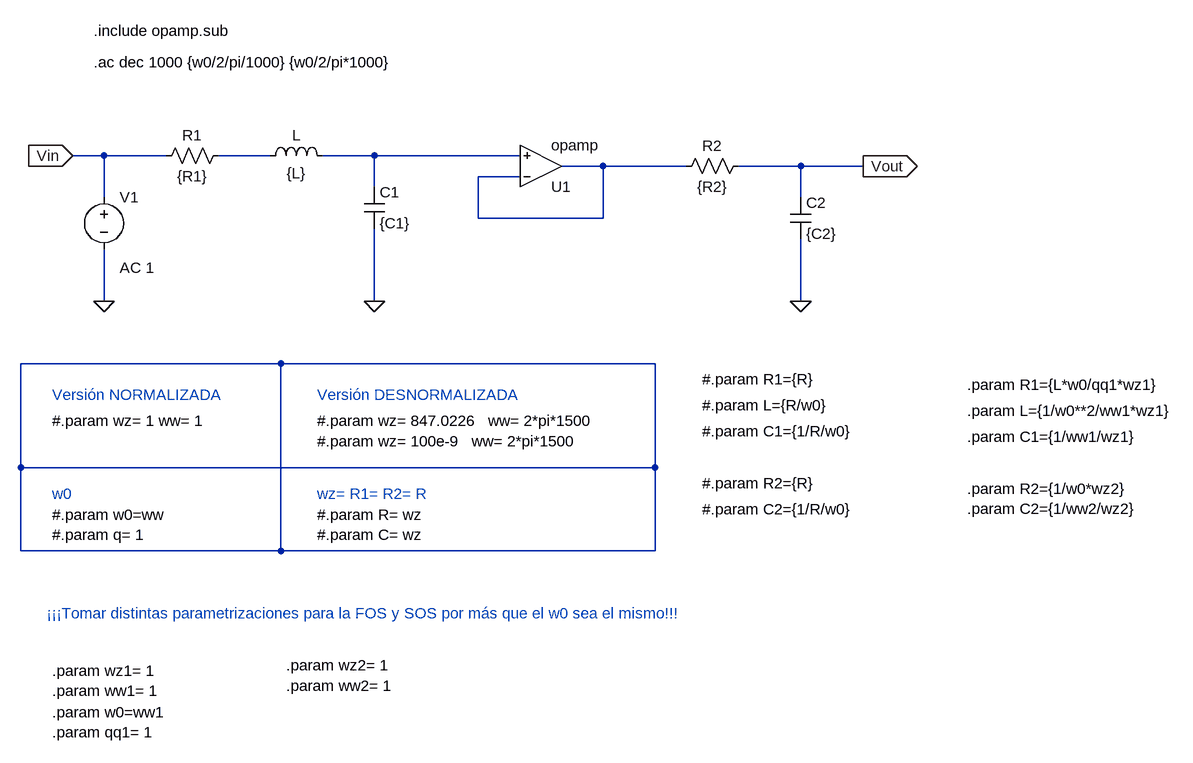
[diagram p0: schematic TS3_LTSpice.asc]
TS3_LTSpice.asc, the LTspice schematic file:
Version 4
SHEET 1 1836 888
WIRE -400 -208 -448 -208
WIRE -304 -208 -400 -208
WIRE -144 -208 -224 -208
WIRE 16 -208 -64 -208
WIRE 240 -208 16 -208
WIRE 368 -192 304 -192
WIRE 496 -192 368 -192
WIRE 672 -192 576 -192
WIRE 768 -192 672 -192
WIRE 240 -176 176 -176
WIRE 16 -160 16 -208
WIRE -400 -144 -400 -208
WIRE 672 -144 672 -192
WIRE 176 -112 176 -176
WIRE 368 -112 368 -192
WIRE 368 -112 176 -112
WIRE -400 16 -400 -64
WIRE 16 16 16 -96
WIRE 672 16 672 -80
WIRE -128 112 -528 112
WIRE 448 112 -128 112
WIRE -528 272 -528 112
WIRE 448 272 448 112
WIRE 448 272 -528 272
WIRE -528 400 -528 272
WIRE -128 400 -128 112
WIRE -128 400 -528 400
WIRE 448 400 448 272
WIRE 448 400 -128 400
FLAG 16 16 0
FLAG -400 16 0
FLAG -448 -208 Vin
IOPIN -448 -208 In
FLAG 672 16 0
FLAG 768 -192 Vout
IOPIN 768 -192 Out
SYMBOL Opamps\\opamp 272 -128 M180
SYMATTR InstName U1
SYMBOL res -208 -224 R90
WINDOW 0 0 56 VBottom 2
WINDOW 3 32 56 VTop 2
SYMATTR InstName R1
SYMATTR Value {R1}
SYMBOL cap 0 -160 R0
SYMATTR InstName C1
SYMATTR Value {C1}
SYMBOL res 592 -208 R90
WINDOW 0 0 56 VBottom 2
WINDOW 3 32 56 VTop 2
SYMATTR InstName R2
SYMATTR Value {R2}
SYMBOL cap 656 -144 R0
SYMATTR InstName C2
SYMATTR Value {C2}
SYMBOL voltage -400 -160 R0
WINDOW 123 24 124 Left 2
WINDOW 39 0 0 Left 0
SYMATTR Value2 AC 1
SYMATTR InstName V1
SYMATTR Value ""
SYMBOL ind -160 -192 R270
WINDOW 0 32 56 VTop 2
WINDOW 3 5 56 VBottom 2
SYMATTR InstName L
SYMATTR Value {L}
TEXT -416 -400 Left 2 !.include opamp.sub
TEXT -416 -352 Left 2 !.ac dec 1000 {w0/2/pi/1000} {w0/2/pi*1000}
TEXT -480 160 Left 2 ;Versión NORMALIZADA
TEXT -480 200 Left 2 !#.param wz= 1 ww= 1
TEXT -72 160 Left 2 ;Versión DESNORMALIZADA
TEXT -72 200 Left 2 !#.param wz= 847.0226   ww= 2*pi*1500\n#.param wz= 100e-9   ww= 2*pi*1500
TEXT 520 216 Left 2 !#.param C1={1/R/w0}
TEXT -480 312 Left 2 ;w0
TEXT -480 344 Left 2 !#.param w0=ww\n#.param q= 1
TEXT -72 312 Left 2 ;wz= R1= R2= R
TEXT -72 344 Left 2 !#.param R= wz\n#.param C= wz
TEXT 520 336 Left 2 !#.param C2={1/R/w0}
TEXT 520 136 Left 2 !#.param R1={R}
TEXT 520 296 Left 2 !#.param R2={R}
TEXT 520 176 Left 2 !#.param L={R/w0}
TEXT 928 224 Left 2 !.param C1={1/ww1/wz1}
TEXT 928 144 Left 2 !.param R1={L*w0/qq1*wz1}
TEXT 928 304 Left 2 !.param R2={1/w0*wz2}\n.param C2={1/ww2/wz2}
TEXT 928 184 Left 2 !.param L={1/w0**2/ww1*wz1}
TEXT -488 496 Left 2 ;¡¡¡Tomar distintas parametrizaciones para la FOS y SOS por más que el w0 sea el mismo!!!
TEXT -480 584 Left 2 !.param wz1= 1\n.param ww1= 1
TEXT -480 648 Left 2 !.param w0=ww1\n.param qq1= 1
TEXT -120 576 Left 2 !.param wz2= 1\n.param ww2= 1

The netlist it stands for:
* TS3_LTSpice.asc
XU1 N003 N002 N003 opamp Aol=100K GBW=10Meg  ; pins invin noninvin out
R1 N001 Vin {R1}
C1 N002 0 {C1}
R2 Vout N003 {R2}
C2 Vout 0 {C2}
V1 Vin 0 AC 1
L N001 N002 {L}
.include opamp.sub
.ac dec 1000 {w0/2/pi/1000} {w0/2/pi*1000}
* Versión NORMALIZADA
#.param wz= 1 ww= 1
* Versión DESNORMALIZADA
#.param wz= 847.0226   ww= 2*pi*1500
#.param wz= 100e-9   ww= 2*pi*1500
#.param C1={1/R/w0}
* w0
#.param w0=ww
#.param q= 1
* wz= R1= R2= R
#.param R= wz
#.param C= wz
#.param C2={1/R/w0}
#.param R1={R}
#.param R2={R}
#.param L={R/w0}
.param C1={1/ww1/wz1}
.param R1={L*w0/qq1*wz1}
.param R2={1/w0*wz2}
.param C2={1/ww2/wz2}
.param L={1/w0**2/ww1*wz1}
* ¡¡¡Tomar distintas parametrizaciones para la FOS y SOS por más que el w0 sea el mismo!!!
.param wz1= 1
.param ww1= 1
.param w0=ww1
.param qq1= 1
.param wz2= 1
.param ww2= 1
.backanno
.end